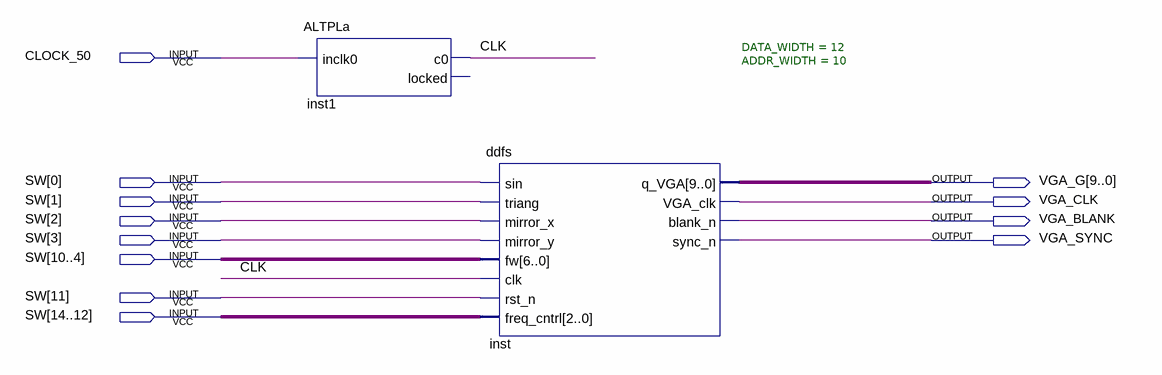
[diagram p0: schematic sheet]
// Quartus schematic funct_gen.bdf as structural Verilog: 2 symbols, 12 pins
module funct_gen (
  input  CLOCK_50,
  input  [14:0] SW,
  output [9:0] VGA_G,
  output VGA_CLK,
  output VGA_BLANK,
  output VGA_SYNC
);

  wire CLK;

  ALTPLa inst1 (.inclk0(CLOCK_50), .c0(CLK));  // open: locked
  ddfs #(.DATA_WIDTH(12), .ADDR_WIDTH(10)) inst (
    .sin(SW[0]), .triang(SW[1]), .mirror_x(SW[2]), .mirror_y(SW[3]), .fw(SW[10:4]), .clk(CLK),
    .rst_n(SW[11]), .freq_cntrl(SW[14:12]), .q_VGA(VGA_G), .VGA_clk(VGA_CLK), .blank_n(VGA_BLANK),
    .sync_n(VGA_SYNC));
endmodule
